# EAGLE design HD44780_ATTINY13 (EAGLE 6.2)
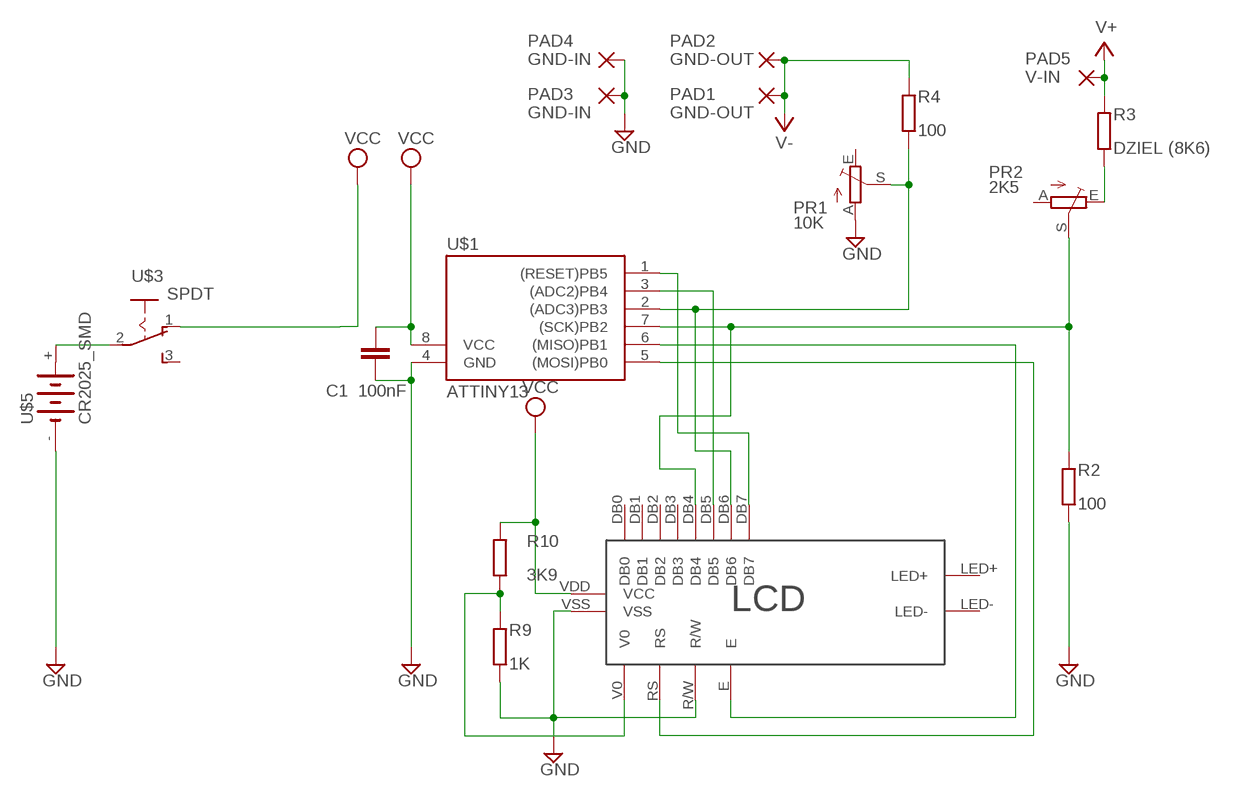
[diagram p0: schematic, sheet 1]

## Parts
C1  100nF  C-EUC0805  [C0805]
PAD1  GND-OUT  2,54/0,8  [2,54/0,8]
PAD2  GND-OUT  2,54/0,8  [2,54/0,8]
PAD3  GND-IN  2,54/0,8  [2,54/0,8]
PAD4  GND-IN  2,54/0,8  [2,54/0,8]
PAD5  V-IN  2,54/0,8  [2,54/0,8]
PR1  10K  TRIM_EU-CA6V  [CA6V]
PR2  2K5  TRIM_EU-CA6V  [CA6V]
R2  100  R-EU_R0805  [R0805]
R3  DZIEL (8K6)  R-EU_R0805  [R0805]
R4  100  R-EU_R0805  [R0805]
R9  1K  R-EU_R0805  [R0805]
R10  3K9  R-EU_R0805  [R0805]
U$1  ATTINY13  TINY138S2  [SO08]
U$2  LGDM1602N1  [GDM1602N1]
U$3  SPDT  [SPDT]
U$5  CR2025_SMD  [CR2025_SMD]

## Nets
GND: C1.2 PAD3.1(P) PAD4.1(P) PR1.A R2.1 R9.1 U$1.4(GND) U$2.R/W U$2.VSS U$5.-
N$1: R9.2 R10.1 U$2.V0
N$2: U$1.3((ADC2)PB4) U$2.DB5
N$3: PR2.E R3.1
N$4: U$3.2(P) U$5.+
N$5: U$1.1((RESET)PB5) U$2.DB7
N$6: U$1.6((MISO)PB1) U$2.E
N$7: U$1.5((MOSI)PB0) U$2.RS
N$10: PR1.S R4.1 U$1.2((ADC3)PB3) U$2.DB6
N$12: PR2.S R2.2 U$1.7((SCK)PB2) U$2.DB4
V+: PAD5.1(P) R3.2
V-: PAD1.1(P) PAD2.1(P) R4.2
VBUS: U$3.1(O)
VCC: C1.1 R10.2 U$1.8(VCC) U$2.VDD(VCC)
Unconnected: PR1.E PR2.A U$2.DB0 U$2.DB1 U$2.DB2 U$2.DB3 U$2.LED+ U$2.LED- U$3.3(S)

## Library data of the parts
C1 = rcl:C-EU: CAPACITOR, European symbol
PAD1-PAD5 = wirepad:2,54/0,8: THROUGH-HOLE PAD
PR1 PR2 = pot:TRIM_EU-: POTENTIOMETER
R2-R4 R9 R10 = rcl:R-EU_: RESISTOR, European symbol
U$1 = avr-4:TINY13*
U$2 = lcd:LGDM1602N1
U$3 = SPDT switch:SPDT: http://ro.farnell.com/jsp/search/productdetail.jsp?SKU=1201431
U$5 = cr2025:CR2025_SMD

## Net classes
3 usbvcc: width 0.254 mm, drill 0.61 mm, clearance 0.254 mm

## Board
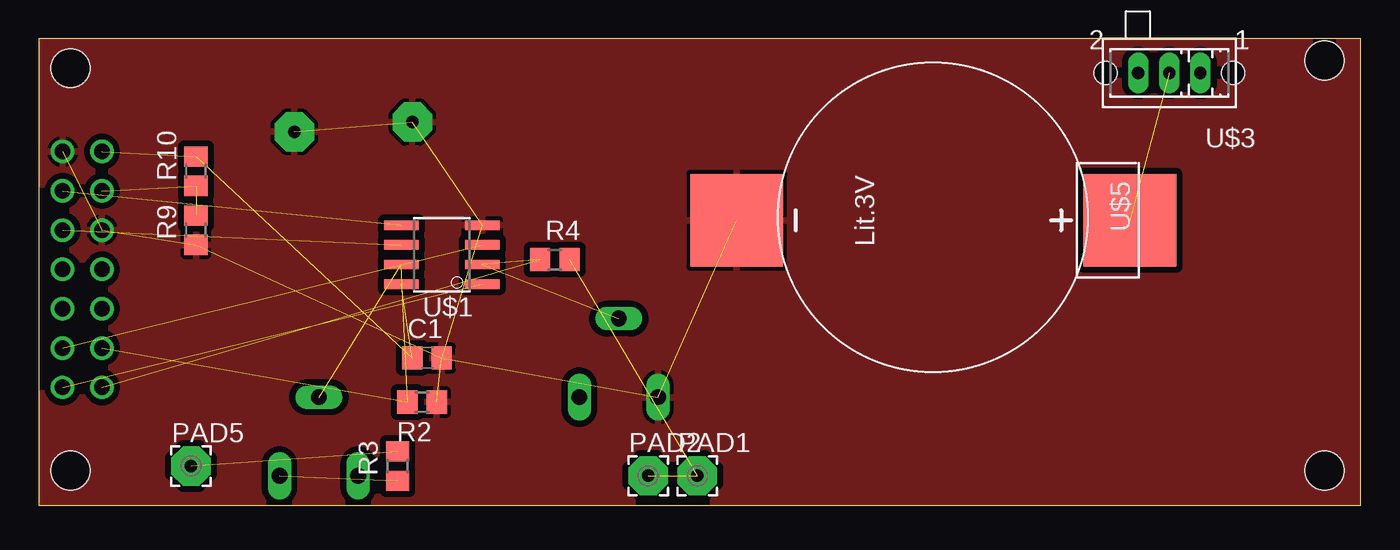
[diagram p1: board, top side]
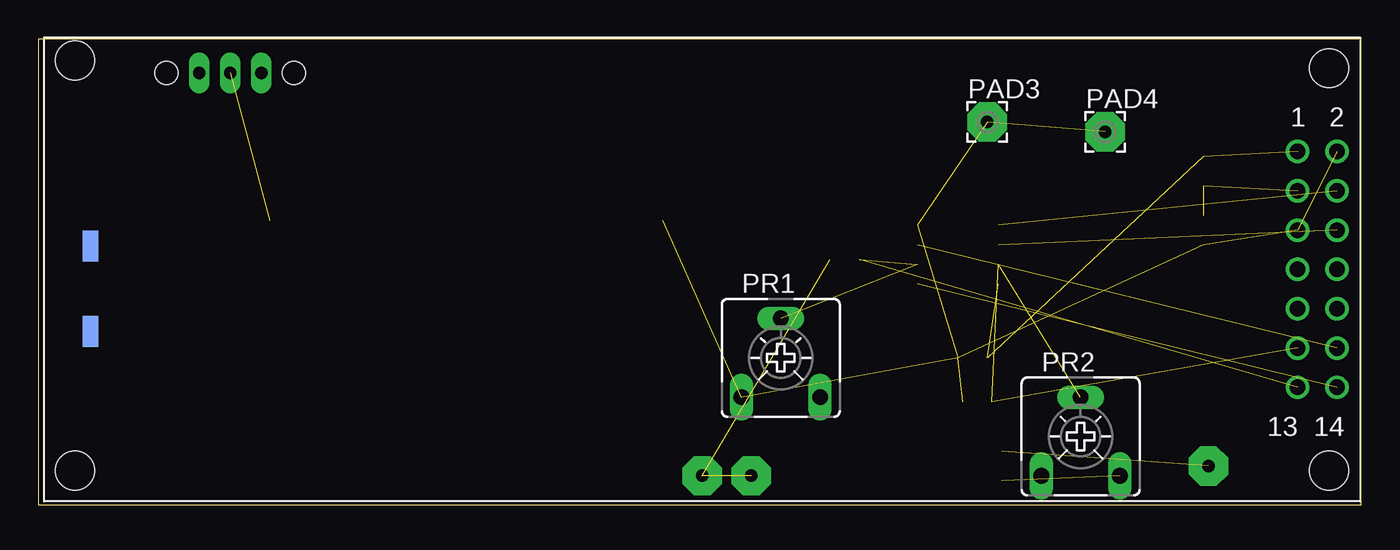
[diagram p2: board, bottom side, seen from below]

Size 85.39 x 30.15 mm. Coordinates in mm from the lower left corner, seen from the top.
Outline: 0,0 85.39,0 85.39,30.15 0,30.15 0,0
Copper layers (1*16): Top 0.035mm / dielectric 1.5mm / Bottom 0.035mm
Design rules: minimum track width 10mil, minimum drill 24mil, track to track 16mil, track to pad 16mil, pad to pad 16mil, via to via 16mil, smd to smd 16mil, copper to edge 1mil, drill to drill 8mil, minimum pad ring 10mil, minimum via ring 8mil, stop-mask expansion 4mil, vias tented up to drill 0mil, thermal gap 10mil

### Footprints (pad centres in the part's own frame; a part is rotated, then mirrored left to right if it is on the bottom)
C0805 = smd 1.3 x 1.5: 1 -0.95,0; 2 0.95,0
2,54/0,8 = drill 0.813 pad 2.54 octagon: 1 0,0
CA6V = drill 1.016 long: A -2.54,-2.54; E 2.54,-2.54; S 0,2.54
R0805 = smd 1.3 x 1.5: 1 -0.95,0; 2 0.95,0
SO08 = smd 0.61 x 2.21: 1 -1.905,-2.616; 2 -0.635,-2.616; 3 0.635,-2.616; 4 1.905,-2.616; 5 1.905,2.616; 6 0.635,2.616; 7 -0.635,2.616; 8 -1.905,2.616
GDM1602N1 = drill 1: DB0 -38.46,0; DB1 -41,0; DB2 -38.46,2.54; DB3 -41,2.54; DB4 -38.46,5.08; DB5 -41,5.08; DB6 -38.46,7.62; DB7 -41,7.62; E -41,-2.54; R/W -38.46,-2.54; RS -41,-5.08; V0 -38.46,-5.08; VDD -38.46,-7.62; VSS -41,-7.62 | smd 1 x 2: LED+ 39.5,4; LED- 39.5,-1.5 | hole 2.5: -40.5,-13; -40.5,13; 40.5,13; 40.5,-13.5
SPDT = drill 0.8 long: 1 -2.007,0; 2 0,0; 3 2.007,0 | hole 1.5: -4.115,0; 4.115,0
CR2025_SMD = smd 6 x 6: + 0,11.43; - 0,-13.97

### Placement (x,y rotation side)
C1  25.08,9.53 0 top
PAD1  42.54,1.9 0 top
PAD2  39.37,1.9 0 top
PAD3  24.13,24.76 0 bottom
PAD4  16.51,24.13 0 bottom
PAD5  9.84,2.54 0 top
PR1  37.46,9.53 0 bottom
PR2  18.1,4.45 0 bottom
R2  24.77,6.67 180 top
R3  23.18,2.54 90 top
R4  33.34,15.87 0 top
R9  10.16,17.78 90 top
R10  10.16,21.59 90 top
U$1  26.04,16.19 90 top
U$2  42.54,15.24 180 bottom
U$3  73.02,27.94 180 top
U$5  59.05,18.41 270 top

### Tracks (layer width: path | path; a pad name or v marks a point on that pad's centre or on a via)
GND  (9 unrouted)
  pour Top: 0,30.16 85.41,30.16 85.41,0 0,0
N$1  (2 unrouted)
N$2  (1 unrouted)
N$3  (1 unrouted)
N$4  (1 unrouted)
N$5  (1 unrouted)
N$6  (1 unrouted)
N$7  (1 unrouted)
N$10  (3 unrouted)
N$12  (3 unrouted)
V+  (1 unrouted)
V-  (2 unrouted)
VCC  (3 unrouted)